# EasyEDA schematic Sensors.json
TITLE: Sensors; REV: 1.0; Date: 2022-01-01; Sheet: 4/4; Drawn By: Mikita Valatovich; Company: MUNI MASTER DIPLOMA
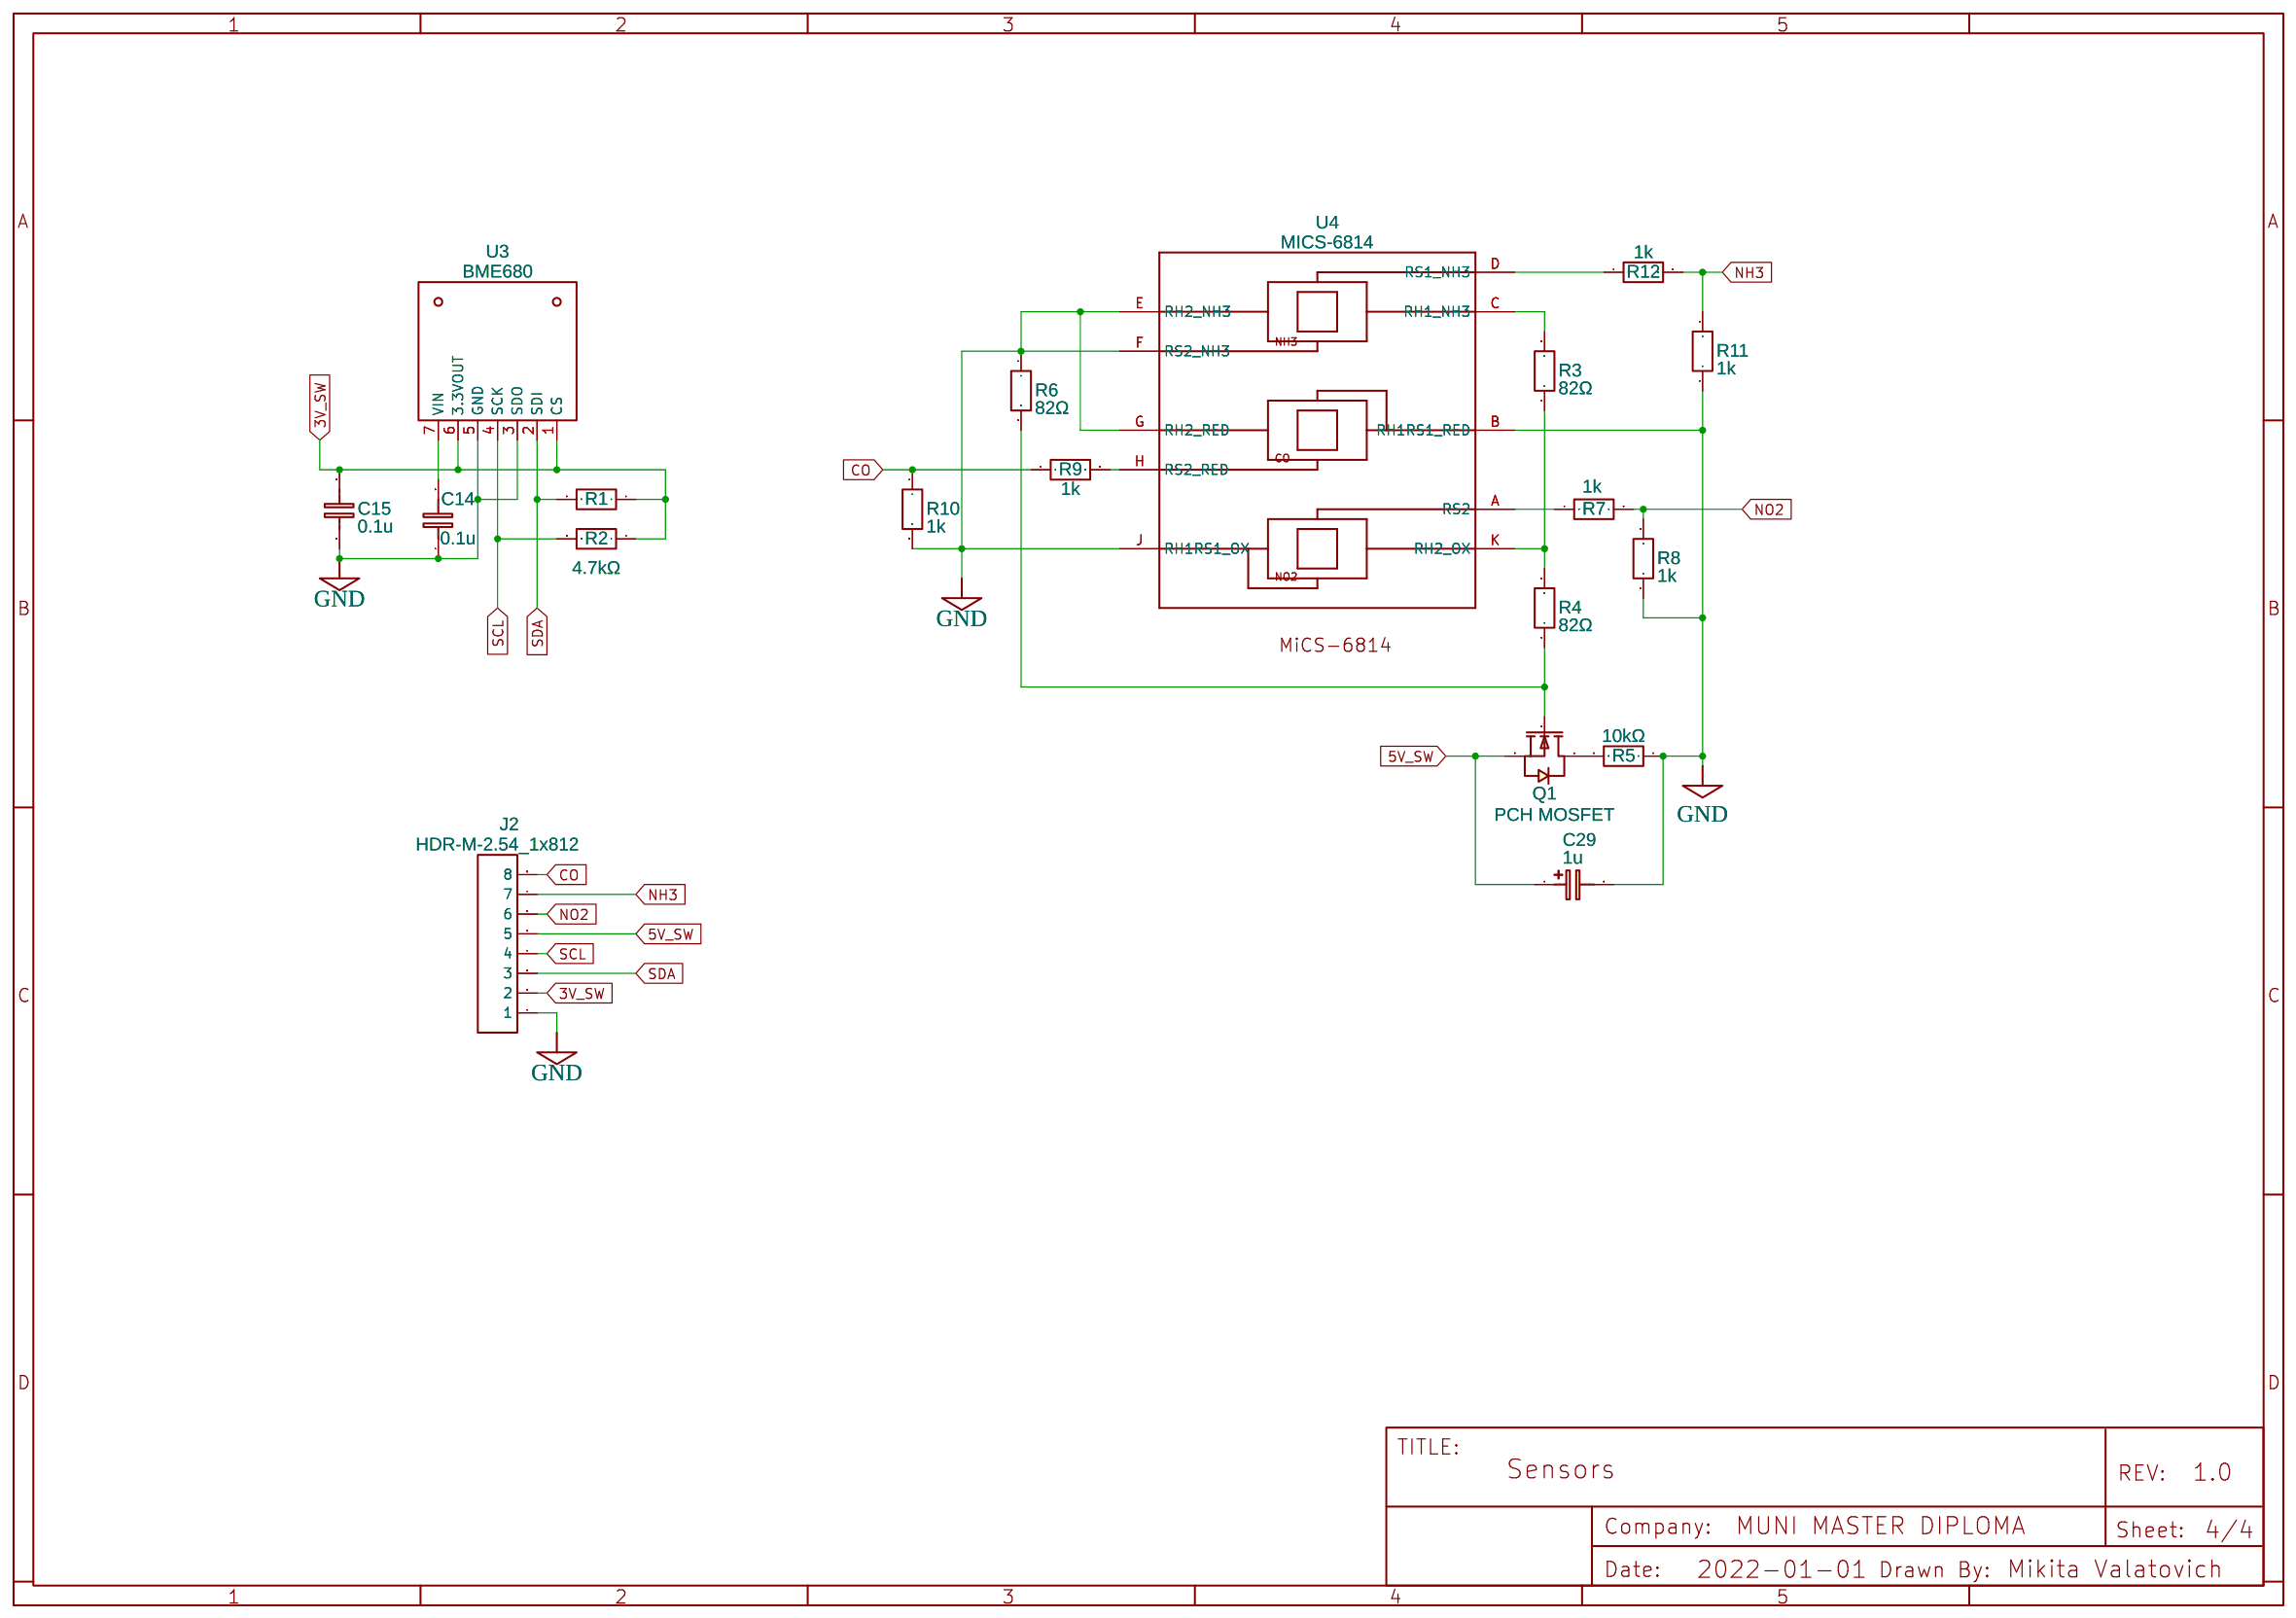
[diagram p0: schematic sheet]

## Parts
C14  0.1u  [C0603]
C15  0.1u  [C0603]
C29  1u  [CASE-A_3216]
J2  HDR-M-2.54_1x812  [HDR-M-2.54_1X8]
Q1  PCH MOSFET  [PG-SOT23-3_L2.9-W1.3-P1.90-LS2.4-BR]
R1  4.7kΩ  [R0603]
R2  4.7kΩ  [R0603]
R3  82Ω  [R0603]
R4  82Ω  [R0603]
R5  10kΩ  [R0603]
R6  82Ω  [R0603]
R7  1k  [R0603]
R8  1k  [R0603]
R9  1k  [R0603]
R10  1k  [R0603]
R11  1k  [R0603]
R12  1k  [R0603]
U3  BME680  [LGA-8-3X3MM]
U4  MICS-6814  [SNR10-SMD-1.25-7.5X5.5MM]

## Library data of the parts
C14 C15 = C_0603_EU: Contributor: LCEDA_Lib
C29 = C_Tan_SMD_A_EU: Contributor: LCEDA_Lib
J2 = HDR-M-2.54_1x812: Supplier Part: C190820; Supplier: LCSC; Contributor: Hane_Jared
Q1 = VB1240B: Supplier: LCSC; Supplier Part: C516873; Manufacturer: VBsemi Elec; Contributor: LCSC; JLCPCB Part Class: Extended Part
R1 R2 = TC0350D4701T5H: Supplier: LCSC; Supplier Part: C517493; Manufacturer: UNI-ROYAL(Uniroyal Elec); Contributor: LCSC; JLCPCB Part Class: Extended Part
R3-R6 = TCTR0603F47K0F3960T: Supplier: LCSC; Supplier Part: C525388; Manufacturer: Resistor.Today; Contributor: LCSC; JLCPCB Part Class: Extended Part
R7-R12 = R_0603_EU: Contributor: LCEDA_Lib
U3 = BME680_ADAFRUIT: Supplier: LCSC; Supplier Part: C125972; Manufacturer: Bosch Sensortec; Contributor: mecopela
U4 = SENSOR-MICS-6814: 314100015; Contributor: sozturk

## Nets
3V_SW: C15.2 J2.2 R1.1 R2.1 U3.1(CS) U3.6(3.3VOUT)
5V_SW: C29.1 J2.5 Q1.2(S)
GND: C14.1 C15.1 C29.2 J2.1 R5.1 R6.1 R8.1 R10.2 R11.2 U3.3(SDO) U3.5(GND) U4.B(RH1RS1_RED) U4.E(RH2_NH3) U4.F(RS2_NH3) U4.G(RH2_RED) U4.J(RH1RS1_OX)
CO: J2.8 R9.1 R10.1
NH3: J2.7 R11.1 R12.2
NO2: J2.6 R7.2 R8.2
SCL: J2.4 R2.2 U3.4(SCK)
SDA: J2.3 R1.2 U3.2(SDI)
Net-(C14-2): C14.2 U3.7(VIN)
Net-(Q1-1): Q1.1(G) R4.1 R6.2
Net-(Q1-3): Q1.3(D) R5.2
Net-(R3-1): R3.1 R4.2 U4.K(RH2_OX)
Net-(R3-2): R3.2 U4.C(RH1_NH3)
Net-(R7-1): R7.1 U4.A(RS2)
Net-(R9-2): R9.2 U4.H(RS2_RED)
Net-(R12-1): R12.1 U4.D(RS1_NH3)
